# Altium schematic sheet DAC.SchDoc: DAC
size A3; Author: M.Beldyga; CompanyName: WUT ISE; DrawnBy: M.Beldyga; Organization: WUT ISE; Address1: PW ISE; Address2: Nowowiejska 15/19 00-665 Warsaw; Address3: micbeldyga@gmail.com; SheetNumber: 6; SheetTotal: 7; ModifiedBy: -; CheckedDate: -; Title2: 1 ppm 20b; DivGrp: WUT ISE; Designer: M.Beldyga; ModifiedDate: -; ProjectName: Sensor Box
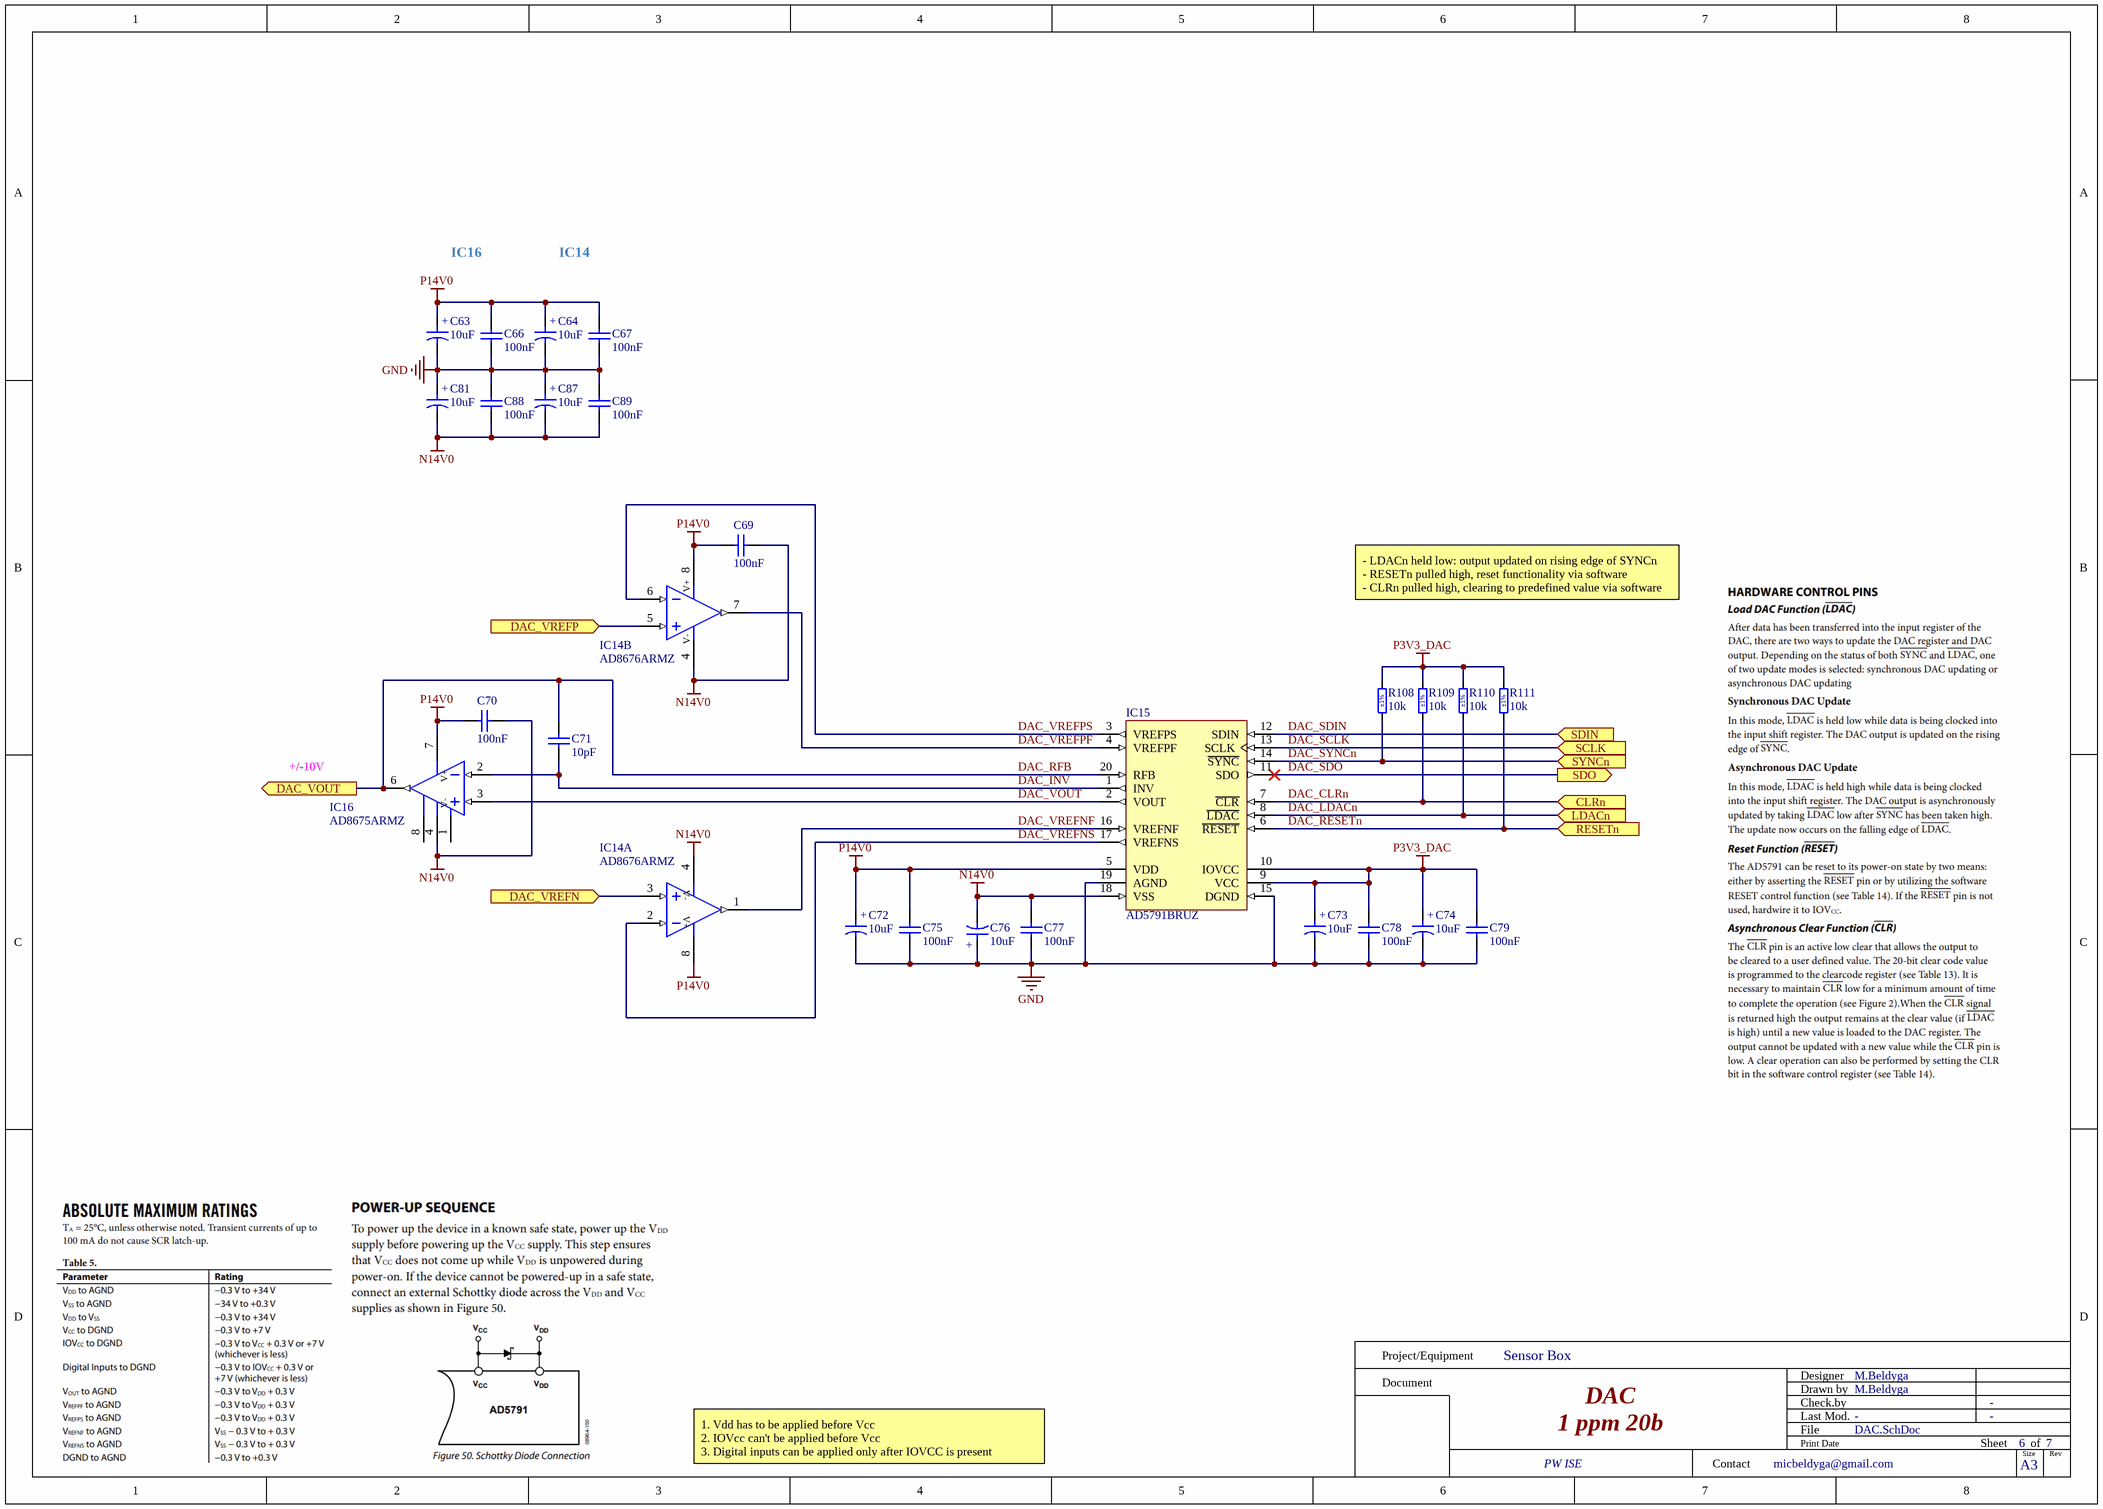
[diagram p0: DAC.SchDoc]

## Parts
C63  10uF  [CAPMP3216X180N]
C64  10uF  [CAPMP3216X180N]
C66  100nF  [CAPC1005X55N]
C67  100nF  [CAPC1005X55N]
C69  100nF  [CAPC1005X55N]
C70  100nF  [CAPC1005X55N]
C71  10pF  [CAPC1005X55N]
C72  10uF  [CAPMP3216X180N]
C73  10uF  [CAPMP3216X180N]
C74  10uF  [CAPMP3216X180N]
C75  100nF  [CAPC1005X55N]
C76  10uF  [CAPMP3216X180N]
C77  100nF  [CAPC1005X55N]
C78  100nF  [CAPC1005X55N]
C79  100nF  [CAPC1005X55N]
C81  10uF  [CAPMP3216X180N]
C87  10uF  [CAPMP3216X180N]
C88  100nF  [CAPC1005X55N]
C89  100nF  [CAPC1005X55N]
IC14  AD8676ARMZ  [SOP65P490X110-8N]  (parts A,B of 2)
IC15  AD5791BRUZ  [SOP65P640X120-20N]
IC16  AD8675ARMZ  [SOP65P490X110-8N]
R108  10k  Tolerance: ±1%  [RESC1005X40N]
R109  10k  Tolerance: ±1%  [RESC1005X40N]
R110  10k  Tolerance: ±1%  [RESC1005X40N]
R111  10k  Tolerance: ±1%  [RESC1005X40N]

## Ports
CLRn (in), DAC_VOUT (out), DAC_VREFN (in), DAC_VREFP (in), LDACn (in), RESETn (in), SCLK (in), SDIN (in), SDO (out), SYNCn (in)

## Nets
GND: C63.2 C64.2 C66.1 C67.1 C72.2 C73.2 C74.2 C75.1 C76.1 C77.1 C78.1 C79.1 C81.1 C87.1 C88.2 C89.2 IC15.15(DGND) IC15.19(AGND)
N14V0: C69.1 C70.1 C76.2 C77.2 C81.2 C87.2 C88.1 C89.1 IC14.4(V-) IC15.18(VSS) IC16.4(V-)
P3V3_DAC: C73.1 C74.1 C78.2 C79.2 IC15.9(VCC) IC15.10(IOVCC) R108.2 R109.2 R110.2 R111.2
P14V0: C63.1 C64.1 C66.2 C67.2 C69.2 C70.2 C72.1 C75.2 IC14.8(V+) IC15.5(VDD) IC16.7(V+)
DAC_CLRn: IC15.7(~{CLR}) R109.1 ; port CLRn
DAC_INV: C71.1 IC15.1(INV) IC16.2(IN-)
DAC_LDACn: IC15.8(~{LDAC}) R110.1 ; port LDACn
DAC_RESETn: IC15.6(~{RESET}) R111.1 ; port RESETn
DAC_RFB: C71.2 IC15.20(RFB) IC16.6(OUT) ; port DAC_VOUT
DAC_SCLK: IC15.13(SCLK) ; port SCLK
DAC_SDIN: IC15.12(SDIN) ; port SDIN
DAC_SDO: IC15.11(SDO) ; port SDO
DAC_SYNCn: IC15.14(~{SYNC}) R108.1 ; port SYNCn
DAC_VOUT: IC15.2(VOUT) IC16.3(IN+)
DAC_VREFN: IC14.3(IN+) ; port DAC_VREFN
DAC_VREFNF: IC14.1(OUT) IC15.16(VREFNF)
DAC_VREFNS: IC14.2(IN-) IC15.17(VREFNS)
DAC_VREFP: IC14.5(IN+) ; port DAC_VREFP
DAC_VREFPF: IC14.7(OUT) IC15.4(VREFPF)
DAC_VREFPS: IC14.6(IN-) IC15.3(VREFPS)

Not connected (* = marked no-connect by the designer): IC16 1(OFFSET) 8(OFFSET)

## Notes on the sheet
- IC16
- IC14
- - LDACn held low: output updated on rising edge of SYNCn
  - RESETn pulled high, reset functionality via software
  - CLRn pulled high, clearing to predefined value via software
- +/-10V
- 1. Vdd has to be applied before Vcc
  2. IOVcc can't be applied before Vcc
  3. Digital inputs can be applied only after IOVCC is present
- Project/Equipment
- Document
- Designer
- Drawn by
- Check.by
- Contact
- File
- Last Mod.
- Print Date
- Sheet
- Size
- A3
- of
- Rev
- (in symbol CTE3216-18_10UF_10V_10%_LESR1800) +

## Library data of the parts
C63 C64 C72-C74 C76 C81 C87 = CTE3216-18_10UF_10V_10%_LESR1800: Polarised capacitor; Part Description: Low ESR 1R8 Solid Tantalum Chip Capacitor; Manufacturer: GENERIC; Manufacturer1 Part Number: TPSA106K010R1800; Voltage: 10V; Tolerance: ±10%; Part Number: CTE3216-18_10UF_10V_10%_LESR1800; Component Kind: Standard; Component Type: Standard; Pin Count: 2; Value: 10uF; Status: Preferred; Manufacturer Part Number: CTE3216-18_10UF_10V_10%_LESR1800; Case: A; Mounted: Yes; Socket: No; SMD: Yes; Sense: No; Manufacturer1 Example: AVX; Manufacturer1 ComponentHeight: 1.8mm; HelpURL: \\cern.ch\dfs\Applications\Altium\Datasheets\CTE-LESR_AVX_TPS.pdf; Author: CERN DEM JLC; CreateDate: 5/5/2008; LatestRevisionDate: 1/20/2009
C66 C67 C69 C70 C75 C77-C79 C88 C89 = CC0402_100NF_50V_10%_X7R: Non-polarised capacitor; Part Description: SMD Multilayer Chip Ceramic Capacitor; Manufacturer: GENERIC; Manufacturer1 Part Number: GRM155R71H104KE14D; Voltage: 50V; TC: X7R; Tolerance: ±10%; Part Number: CC0402_100NF_50V_10%_X7R; Component Kind: Standard; Component Type: Standard; Pin Count: 2; Value: 100nF; Status: None; Manufacturer Part Number: CC0402_100NF_50V_10%_X7R; Case: 0402; Mounted: Yes; Socket: No; SMD: Yes; Sense: No; Manufacturer1 Example: MURATA; Manufacturer1 ComponentHeight: 0.55mm; HelpURL: \\cern.ch\dfs\Applications\Altium\Datasheets\CC0402_MURATA_GRM155R71H104KE14D.pdf; Author: CERN DEM MR; CreateDate: 6/30/2017; LatestRevisionDate: 6/30/2017
C71 = CC0402_10PF_50V_5%_C0G: Non-polarised capacitor; Part Description: SMD Multilayer Chip Ceramic Capacitor; Manufacturer: GENERIC; Manufacturer1 Part Number: C0402C100J5GACTU; Voltage: 50V; TC: C0G/NP0; Tolerance: ±5%; Part Number: CC0402_10PF_50V_5%_C0G; Component Kind: Standard; Component Type: Standard; Pin Count: 2; Value: 10pF; Status: Preferred; Manufacturer Part Number: CC0402_10PF_50V_5%_C0G; Case: 0402; Mounted: Yes; Socket: No; SMD: Yes; Sense: No; Manufacturer1 Example: KEMET; Manufacturer1 ComponentHeight: 0.55mm; HelpURL: \\cern.ch\dfs\Applications\Altium\Datasheets\CC0402_C0G_KEMET_(Commercial Grade).pdf; Author: CERN DEM JLC; CreateDate: 12/3/2007; LatestRevisionDate: 4/22/2015
IC14 = AD8676ARMZ: Dual Operational Amplifier; Part Description: Ultraprecision, 36 V, 2.8 nV/sqrt Hz Dual Rail-to-Rail Output Operational Amplifier; Manufacturer: ANALOG DEVICES; PressFit: No; Bonding: No; Part Number: AD8676ARMZ; Component Kind: Standard; Component Type: Standard; Device: AD8676ARMZ; PackageDescription: SOP, 0.65mm Pitch; 8 Pin, 3.00mm W X 3.00mm L X 1.10mm H body, IPC Medium Density; Manufacturer Part Number: AD8676ARM; Pin Count: 8; Case: MSOP8; Mounted: Yes; Socket: No; SMD: Yes; Sense: No; ComponentHeight: 1.1mm; Author: CERN DEM JLC; HelpURL: \\cern.ch\dfs\Applications\Altium\Datasheets\AD8676ARMZ.pdf; CreateDate: 12/17/2013; LatestRevisionDate: 3/31/2022
IC15 = AD5791BRUZ: 1 ppm 20-Bit, ±1 LSB INL, Voltage Output DAC; Manufacturer: ANALOG DEVICES; PressFit: No; Bonding: No; Part Number: AD5791BRUZ; Component Kind: Standard; Component Type: Standard; Device: AD5791BRUZ; PackageDescription: SOP, 0.65mm Pitch; 20 Pin, 4.40mm W X 6.50mm L X 1.20mm H body, IPC Medium Density; Part Description: 1 ppm 20-Bit, ±1 LSB INL, Voltage Output DAC; Manufacturer Part Number: AD5791BRU; Pin Count: 20; Case: TSSOP20; Mounted: Yes; Socket: No; SMD: Yes; Sense: No; ComponentHeight: 1.2mm; Author: CERN DEM JLC; HelpURL: \\cern.ch\dfs\Applications\Altium\Datasheets\AD5791BRUZ.pdf; CreateDate: 5/11/2011; LatestRevisionDate: 3/24/2022
IC16 = AD8675ARMZ: Operational Amplifier with Offset 1-8; Part Description: 36V Precision, 2.8nV/sqrt Hz Rail-to-Rail Output Operational Amplifier; Manufacturer: ANALOG DEVICES; PressFit: No; Bonding: No; Part Number: AD8675ARMZ; Component Kind: Standard; Component Type: Standard; Device: AD8675ARMZ; PackageDescription: SOP, 0.65mm Pitch; 8 Pin, 3.00mm W X 3.00mm L X 1.10mm H body, IPC Medium Density; Manufacturer Part Number: AD8675ARM; Pin Count: 8; Case: MSOP8; Mounted: Yes; Socket: No; SMD: Yes; Sense: No; ComponentHeight: 1.1mm; Author: CERN DEM JMW; HelpURL: \\cern.ch\dfs\Applications\Altium\Datasheets\AD8675ARMZ.pdf; CreateDate: 9/6/2011; LatestRevisionDate: 3/31/2022
R108-R111 = R0402_10K_1%_0.0625W_100PPM: Resistor - 1%; Part Description: General Purpose Thick Film Chip Resistor; Manufacturer: GENERIC; Manufacturer1 Part Number: 232270671003L; TC: ±100ppm/°C; PressFit: No; Part Number: R0402_10K_1%_0.0625W_100PPM; Component Kind: Standard; Component Type: Standard; Pin Count: 2; Value: 10k; Status: Not Recommended; Power: 0.0625W; Manufacturer Part Number: R0402_10K_1%_0.0625W_100PPM; Case: 0402; Mounted: Yes; Sense: No; Socket: No; SMD: Yes; Manufacturer1 Example: YAGEO PHYCOMP; Manufacturer1 ComponentHeight: 0.4mm; HelpURL: \\cern.ch\dfs\Applications\Altium\Datasheets\R0402_Phycomp_RC0402.pdf; Author: CERN DEM JLC; CreateDate: 12/3/2007; LatestRevisionDate: 10/17/2012